# EAGLE design lipo-charger (EAGLE 9.5.2)
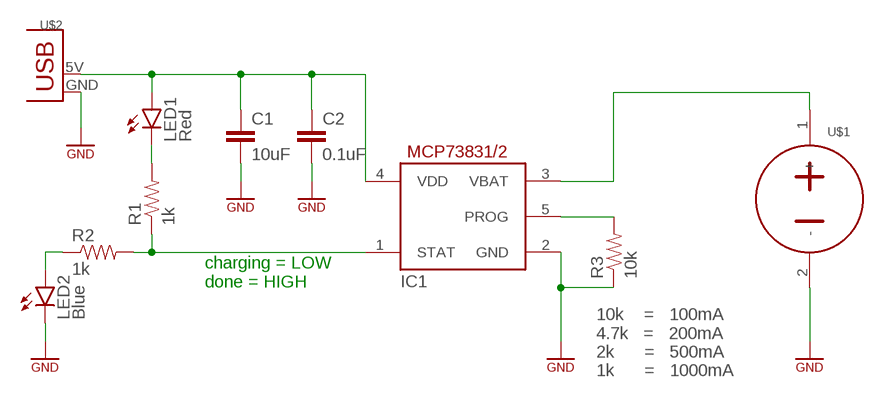
[diagram p0: schematic, sheet 1]

## Parts
C1  10uF  COMPONENT_CAP-0805  [0805]
C2  0.1uF  COMPONENT_CAP-0805  [0805]
IC1  IC_LIPO_CHARGER  [SOT23-5]
LED1  Red  LED-0805  [CHIP-LED0805]
LED2  Blue  LED-0805  [CHIP-LED0805]
R1  1k  COMPONENT_RESISTOR-0805  [0805]
R2  1k  COMPONENT_RESISTOR-0805  [0805]
R3  10k  COMPONENT_RESISTOR-0805  [0805]
U$1  CONN_BATTERY-LIPO-HORIZ  [JST-PH-2-SMT-RA]
U$2  CONN_USB_PCB_POWER  [USB-PCB-POWER]

## Nets
5V: C1.1 C2.1 IC1.4(VDD) LED1.A U$2.5V(VBUS)
BATTERY: IC1.3(VBAT) U$1.1(+)
CURRENT-CONTROL: IC1.5(PROG) R3.2
GND: C1.2 C2.2 IC1.2(GND) LED2.C R3.1 U$1.2(-) U$2.GND ; supply symbol labelled SYMBOL_GND
N$2: LED1.C R1.2
N$3: LED2.A R2.1
STATUS: IC1.1(STAT) R1.1 R2.2

## Notes on the sheet
- charging = LOW
  done = HIGH
- 10k    =   100mA
  4.7k   =   200mA
  2k      =   500mA
  1k      =   1000mA

## Library data of the parts
C1 C2 = homemade-hardware:COMPONENT_CAP: Capacitor Standard 0603 ceramic capacitor, and 0.1" leaded capacitor.
IC1 = homemade-hardware:IC_LIPO_CHARGER: MCP73831/2 <https://www.digikey.com/product-detail/en/microchip-technology/MCP73831T-2ATI-OT/MCP73831T-2ATI-OTCT-ND/1979803>: LiPo Battery Charger
LED1 LED2 = homemade-hardware:LED: LEDs Standard schematic elements and footprints for 5mm, 3mm, 1206, and 0603 sized LEDs. 5mm - Spark Fun Electronics SKU : COM-00529 (and others)
R1-R3 = homemade-hardware:COMPONENT_RESISTOR
U$1 = homemade-hardware:CONN_BATTERY
U$2 = homemade-hardware:CONN_USB_PCB_POWER

## Board
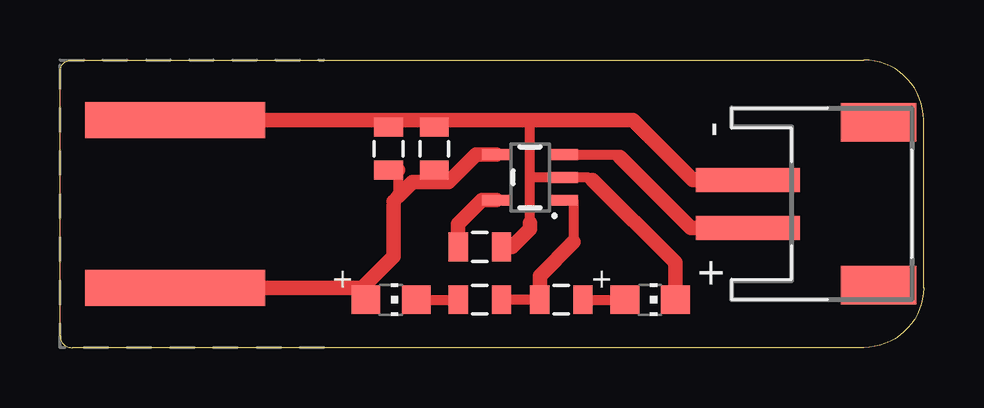
[diagram p1: board, top side]

Size 36 x 12 mm. Coordinates in mm from the lower left corner, seen from the top.
Outline: 0.5,12 33.5,12 arc-90 36,9.5 36,2.5 arc-90 33.5,0 0.5,0 arc-90 0,0.5 0,11.5 arc-90 0.5,12
Copper layers (1*16): Top 0.035mm / dielectric 1.5mm / Bottom 0.035mm
Design rules "default": minimum track width 16mil, minimum drill 0.8mm, track to track 0.8mm, track to pad 0.8mm, pad to pad 0.8mm, via to via 0.8mm, smd to smd 0mil, copper to edge 1mil, drill to drill 1mil, minimum pad ring 10mil, minimum via ring 10mil, stop-mask expansion 1mil, vias tented up to drill 30mil, thermal gap 10mil

### Footprints (pad centres in the part's own frame; a part is rotated, then mirrored left to right if it is on the bottom)
0805 = smd 0.8 x 1.2: 1 -0.9,0; 2 0.9,0
SOT23-5 = smd 0.45 x 1.2: 1 -0.95,-1.4; 2 0,-1.4; 3 0.95,-1.4; 4 0.95,1.4; 5 -0.95,1.4
CHIP-LED0805 = smd 1.2 x 1.2: A 0,-1.05; C 0,1.05
JST-PH-2-SMT-RA = smd 1 x 4.35: 1 1,-3.825; 2 -1,-3.825 | smd 1.6 x 3.15: NC1 -3.4,1.625; NC2 3.4,1.625
USB-PCB-POWER = smd 7.5 x 1.5: 5V -0.2,-3.5; GND -0.2,3.5

### Placement (x,y rotation side)
C1  13.7,8.3 90 top
C2  15.6,8.3 90 top
IC1  19.6,7.1 90 top
LED1  13.8,2 270 top
LED2  24.6,2 270 top
R1  17.5,2 180 top
R2  20.9,2 180 top
R3  17.5,4.2 180 top
U$1  32.5,6 270 top
U$2  5,6 0 top

### Tracks (layer width: path | path; a pad name or v marks a point on that pad's centre or on a via)
5V
  Top 0.406: 14.1,7.4 14.1,6.3 | 13.9,6.1 13.9,5.9 | 15.6,6.9 C2.1 | 12.5,2.25 12.5,2.4 12.5,2.5
  Top 0.61: IC1.4 17.35,8.05 16.2,6.9 15.6,6.9 14.7,6.9 14.1,6.3 13.9,6.1 | 13.9,5.9 13.9,3.8 12.5,2.4 | C1.1 14.1,7.4 | 12.5,2.5 U$2.5V | LED1.A 12.5,2.25
BATTERY
  Top 0.406: IC1.3 23.2,8.05 23.3,7.95 23.35,7.95
  Top 0.61: 23.35,7.95 26.3,5 U$1.1
CURRENT-CONTROL
  Top 0.61: R3.2 16.6,5.15 17.6,6.15 IC1.5
GND
  Top 0.406: 22.2,7 22.1,7 22,7.1 IC1.2 19.6,7.1 | 19.6,5.2 19.6,7.1 | 19.6,7.1 19.6,9.5 | C2.2 15.6,9.5 | C1.2 13.7,9.5
  Top 0.61: 22.2,7 25.65,3.55 LED2.C | U$1.2 26.38,7 23.88,9.5 19.6,9.5 15.6,9.5 13.7,9.5 U$2.GND | R3.1 18.85,4.2 19.6,4.95 19.6,5.2
N$2
  Top 0.406: LED1.C R1.2
N$3
  Top 0.406: R2.1 LED2.A
STATUS
  Top 0.406: R2.2 R1.1 | IC1.1 21.4,6.15 21.4,4.4
  Top 0.61: 21.4,4.4 20,3 R2.2